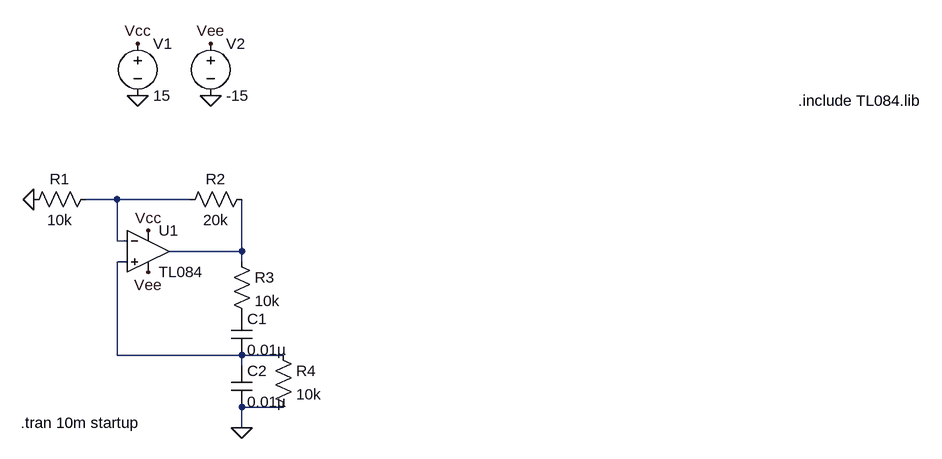
[diagram p0: schematic sineGen.asc]
sineGen.asc, the LTspice schematic file:
Version 4
SHEET 1 880 680
WIRE -816 176 -864 176
WIRE -704 176 -816 176
WIRE -816 240 -816 176
WIRE -800 240 -816 240
WIRE -624 256 -624 176
WIRE -624 256 -736 256
WIRE -800 272 -816 272
WIRE -624 272 -624 256
WIRE -816 416 -816 272
WIRE -624 416 -816 416
WIRE -560 416 -624 416
WIRE -624 432 -624 416
WIRE -560 496 -624 496
WIRE -624 528 -624 496
FLAG -784 16 0
FLAG -672 16 0
FLAG -784 -64 Vcc
FLAG -768 224 Vcc
FLAG -672 -64 Vee
FLAG -768 288 Vee
FLAG -944 176 0
FLAG -624 528 0
SYMBOL Opamps\\opamp2 -768 192 R0
SYMATTR InstName U1
SYMATTR Value TL084
SYMBOL res -848 160 R90
WINDOW 0 0 56 VBottom 2
WINDOW 3 32 56 VTop 2
SYMATTR InstName R1
SYMATTR Value 10k
SYMBOL res -608 160 R90
WINDOW 0 0 56 VBottom 2
WINDOW 3 32 56 VTop 2
SYMATTR InstName R2
SYMATTR Value 20k
SYMBOL voltage -784 -80 R0
WINDOW 123 0 0 Left 0
WINDOW 39 0 0 Left 0
SYMATTR InstName V1
SYMATTR Value 15
SYMBOL voltage -672 -80 R0
WINDOW 123 0 0 Left 0
WINDOW 39 0 0 Left 0
SYMATTR InstName V2
SYMATTR Value -15
SYMBOL cap -640 352 R0
SYMATTR InstName C1
SYMATTR Value 0.01µ
SYMBOL res -640 256 R0
SYMATTR InstName R3
SYMATTR Value 10k
SYMBOL res -576 400 R0
SYMATTR InstName R4
SYMATTR Value 10k
SYMBOL cap -640 432 R0
SYMATTR InstName C2
SYMATTR Value 0.01µ
TEXT 232 24 Left 2 !.include TL084.lib
TEXT -964 520 Left 2 !.tran 10m startup

The netlist it stands for:
* sineGen.asc
XU1 N003 N001 Vcc Vee N002 TL084  ; pins In+ In- V+ V- OUT
R1 N001 0 10k
R2 N002 N001 20k
V1 Vcc 0 15
V2 Vee 0 -15
C1 P001 N003 0.01µ
R3 N002 P001 10k
R4 N003 0 10k
C2 N003 0 0.01µ
.include TL084.lib
.tran 10m startup
.backanno
.end